# EAGLE schematic Wiegezelle (EAGLE 7.7.0)
AUTHOR: Eltra EW; DESCRIPION: test; DESCRIPTION: Platine an Schlitten; VERSION: V1.0
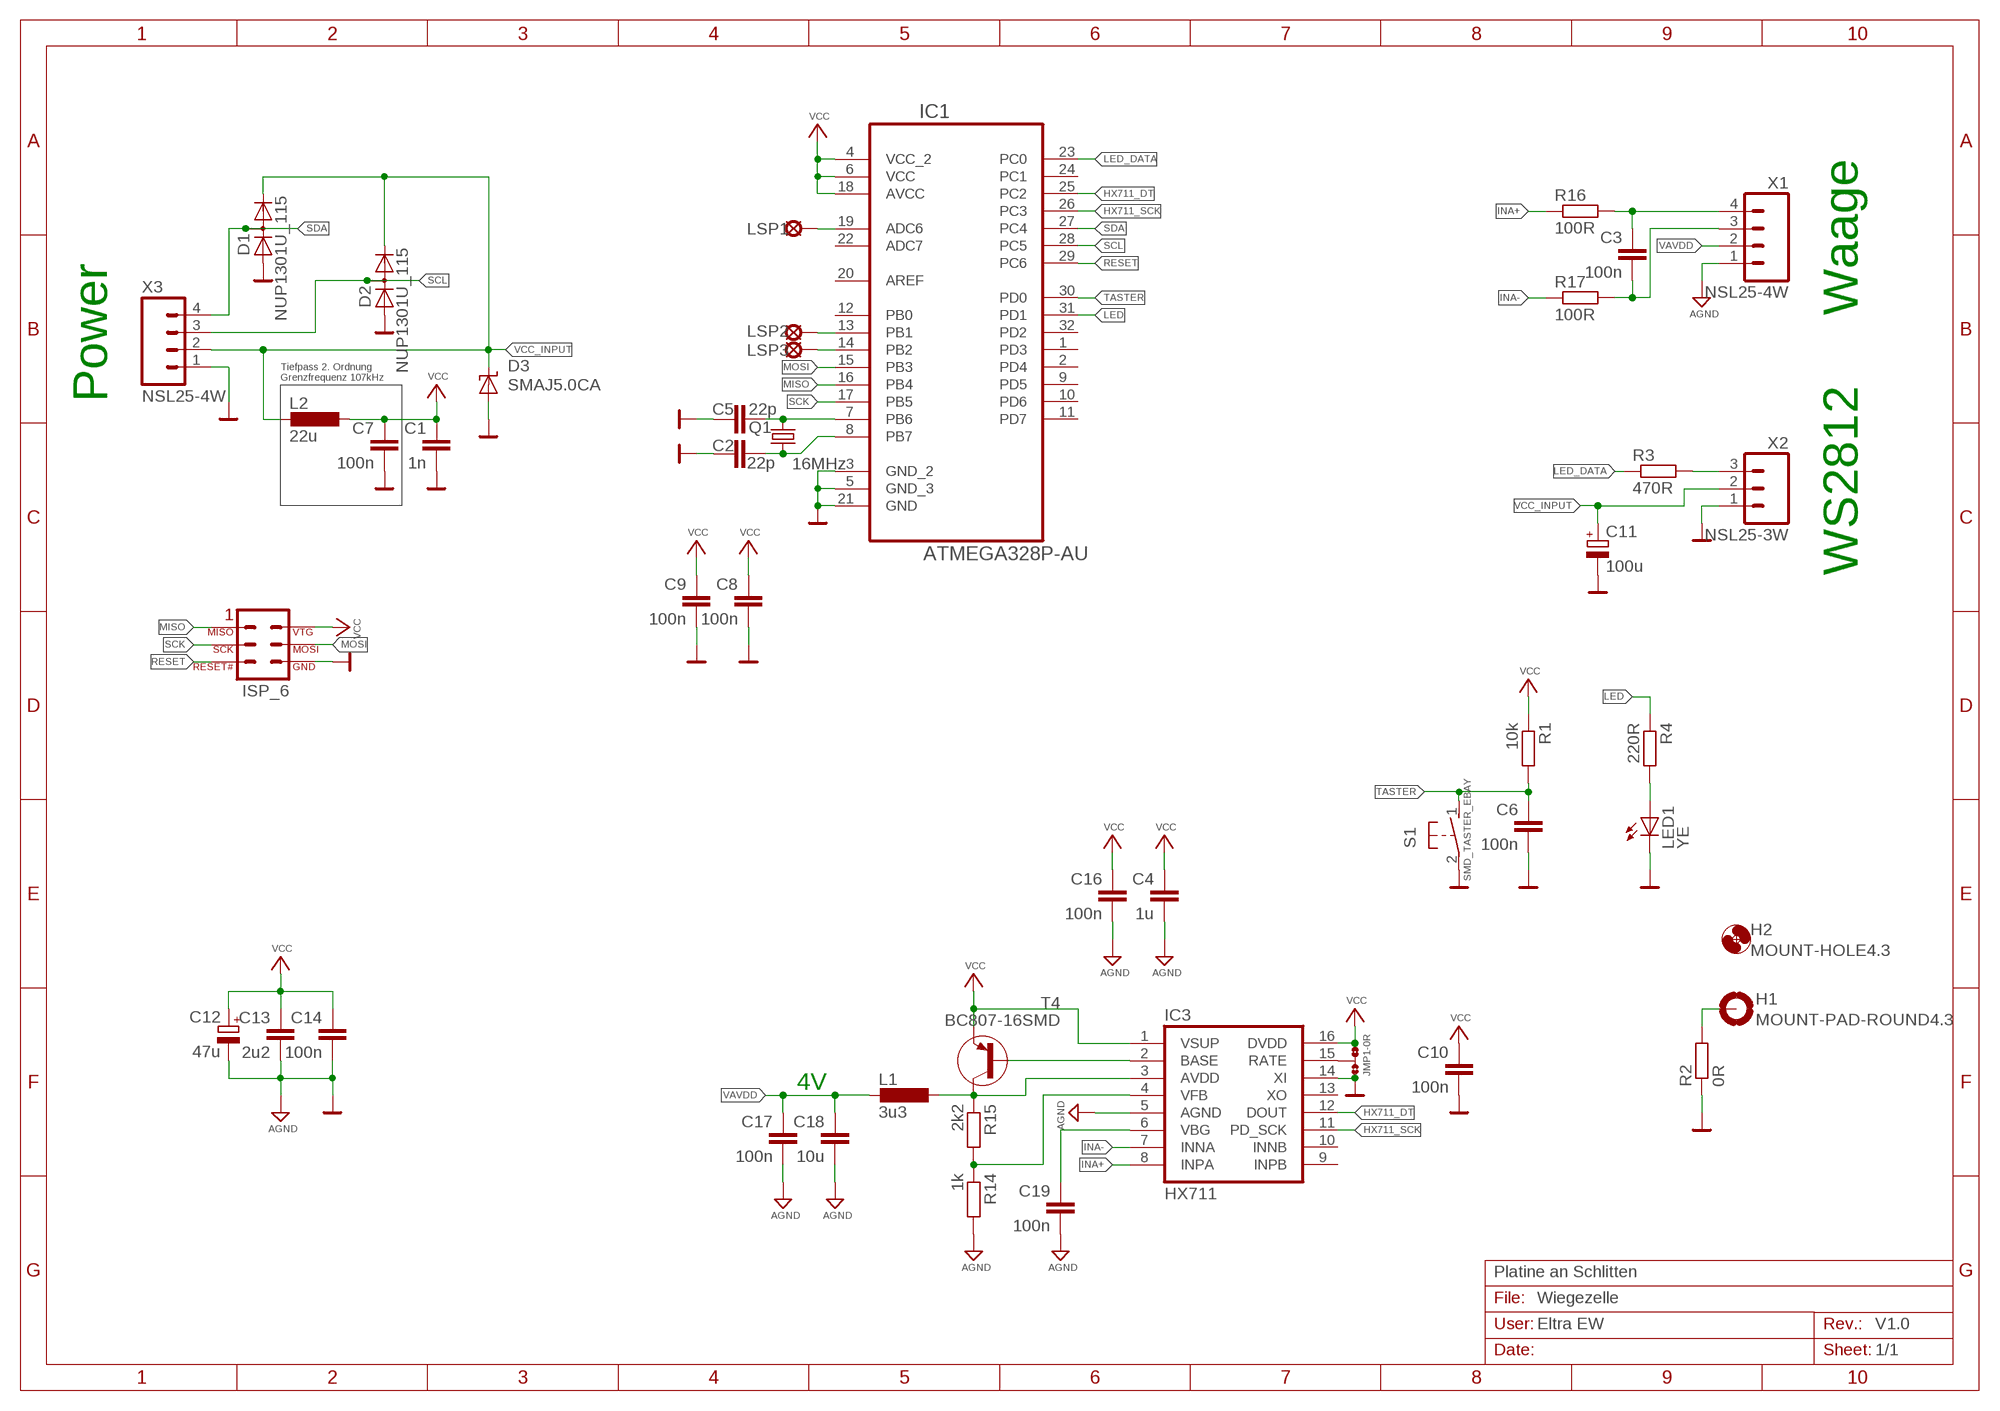
[diagram p0: schematic, sheet 1]

## Parts
C1  1n  C-EUC0805CRH  [0805CRH]
C2  22p  C-EUC0805CRH  [0805CRH]
C3  100n  C-EUC0805CRH  [0805CRH]
C4  1u  C-EUC0805CRH  [0805CRH]
C5  22p  C-EUC0805CRH  [0805CRH]
C6  100n  C-EUC0805CRH  [0805CRH]
C7  100n  C-EUC0805CRH  [0805CRH]
C8  100n  C-EUC0805CRH  [0805CRH]
C9  100n  C-EUC0805CRH  [0805CRH]
C10  100n  C-EUC0805CRH  [0805CRH]
C11  100u  CPOL-EU153CLV-0605  [153CLV-0605]
C12  47u  CPOL-EU153CLV-0405  [153CLV-0405]
C13  2u2  C-EUC0805CRH  [0805CRH]
C14  100n  C-EUC0805CRH  [0805CRH]
C16  100n  C-EUC0805CRH  [0805CRH]
C17  100n  C-EUC0805CRH  [0805CRH]
C18  10u  C-EUC0805CRH  [0805CRH]
C19  100n  C-EUC0805CRH  [0805CRH]
D1  NUP1301U_115  [SOT323-3]
D2  NUP1301U_115  [SOT323-3]
D3  SMAJ5.0CA  SMAJ  [SMA-DO214AC]
H1  MOUNT-PAD-ROUND4.3  [4,3-PAD]
H2  MOUNT-HOLE4.3  [4,3]
IC1  ATMEGA328P-AU  [QFP80P900X900X120-32N]
IC3  HX711  [SO16]
JMP1  0R-JUMPA  [A0R-JMP]
L1  3u3  L-EUL0805CRH  [0805CRH]
L2  22u  L-EUL4532P  [L4532P]
LED1  YE  LEDCHIPLED_0805  [CHIPLED_0805]
LSP1  LSP06  [LSP06]
LSP2  LSP06  [LSP06]
LSP3  LSP06  [LSP06]
Q1  16MHz  CRYSTALHC49UP  [HC49UP]
R1  10k  R-EU_R0805CRH  [0805CRH]
R2  0R  R-EU_R0805CRH  [0805CRH]
R3  470R  R-EU_R0805CRH  [0805CRH]
R4  220R  R-EU_R0805CRH  [0805CRH]
R14  1k  R-EU_R0805CRH  [0805CRH]
R15  2k2  R-EU_R0805CRH  [0805CRH]
R16  100R  R-EU_R0805CRH  [0805CRH]
R17  100R  R-EU_R0805CRH  [0805CRH]
S1  SMD_TASTER_EBAY  [DTSM3XN]
SV1  ATMEL_ISP_6  [ML6]
T4  BC807-16SMD  [SOT23-BEC]
X1  NSL25-4W  [NSL25-4W]
X2  NSL25-3W  [NSL25-3W]
X3  NSL25-4W  [NSL25-4W]

## Nets
AGND: C4.2 C12.- C13.2 C14.2 C16.2 C17.2 C18.2 C19.2 IC3.5(AGND) R14.2 X1.1 ; supply symbol labelled GND
GND: C1.2 C2.1 C5.1 C6.2 C7.2 C8.2 C9.2 C10.2 C11.- D1.1 D2.1 D3.A IC1.3(GND_2) IC1.5(GND_3) IC1.21(GND) IC3.14(XI) JMP1.3 LED1.C R2.1 S1.2(P) SV1.6 X2.1 X3.1
HX711_DT: IC1.25(PC2) IC3.12(DOUT)
HX711_SCK: IC1.26(PC3) IC3.11(PD_SCK)
INA+: IC3.8(INPA) R16.1
INA-: IC3.7(INNA) R17.1
LED: IC1.31(PD1) R4.1
LED_DATA: IC1.23(PC0) R3.1
MISO: IC1.16(PB4) SV1.1
MOSI: IC1.15(PB3) SV1.4
N$1: H1.B4,3(MOUNT) R2.2
N$2: LED1.A R4.2
N$3: R3.2 X2.3
N$4: C5.2 IC1.7(PB6) Q1.2
N$5: C2.2 IC1.8(PB7) Q1.1
N$6: IC1.19(ADC6) LSP1.MP
N$7: IC1.13(PB1) LSP2.MP
N$8: IC1.14(PB2) LSP3.MP
N$12: IC3.15(RATE) JMP1.2
N$13: C19.1 IC3.6(VBG)
N$14: IC3.2(BASE) T4.B
N$16: IC3.4(VFB) R14.1 R15.2
N$18: C3.1 R16.2 X1.4
N$19: C3.2 R17.2 X1.3
RESET: IC1.29(PC6) SV1.5
SCK: IC1.17(PB5) SV1.3
SCL: D2.3 IC1.28(PC5) X3.3
SDA: D1.3 IC1.27(PC4) X3.4
TASTER: C6.1 IC1.30(PD0) R1.2 S1.1(S)
VAVDD: C17.1 C18.1 L1.2 X1.2
VAVDD_1: IC3.3(AVDD) L1.1 R15.1 T4.C
VCC: C1.1 C4.1 C7.1 C8.1 C9.1 C10.1 C12.+ C13.1 C14.1 C16.1 IC1.4(VCC_2) IC1.6(VCC) IC1.18(AVCC) IC3.1(VSUP) IC3.16(DVDD) JMP1.1 L2.1 R1.1 SV1.2 T4.E
VCC_INPUT: C11.+ D1.2 D2.2 D3.K(C) L2.2 X2.2 X3.2
Unconnected: IC1.1(PD3) IC1.2(PD4) IC1.9(PD5) IC1.10(PD6) IC1.11(PD7) IC1.12(PB0) IC1.20(AREF) IC1.22(ADC7) IC1.24(PC1) IC1.32(PD2) IC3.9(INPB) IC3.10(INNB) IC3.13(XO)

## Notes on the sheet
- Waage
- Tiefpass 2. Ordnung
  Grenzfrequenz 107kHz
- Power
- WS2812
- 4V

## Library data of the parts
C1-C10 C13 C14 C16-C19 = rcl_jci:C-EU: CAPACITOR, European symbol
C11 C12 = rcl_jci:CPOL-EU: POLARIZED CAPACITOR, European symbol
D1 D2 = Diode:NUP1301U_115: ESD-Entstörer/TVS-Dioden, SOT-323-3
D3 = Eltra_Teile:SMAJ: Suppressor diode
H1 = holes_sv:MOUNT-PAD-ROUND: MOUNTING PAD, round
H2 = holes_sv:MOUNT-HOLE: MOUNTING HOLE with drill center marker
IC1 = Atmel:ATMEGA328P-AU: 8-bit Microcontroller with In-System Programmable Flash; PACKAGE: TQFP-32; SUPPLIER: Atmel
IC3 = ADC:HX711
JMP1 = jump-0r-smd:0R-JUMP: SMD 0R 0805 Jumper
L1 L2 = rcl_sv:L-EU: INDUCTOR, European symbol
LED1 = led_jci:LED: LED OSRAM: - CHIPLED LG R971, LG N971, LY N971, LG Q971, LY Q971, LO R971, LY R971 LH N974, LH R974 LS Q976, LO Q976, LY Q976 LO Q996 - Hyper CHIPLED LW Q18S LB Q993, LB Q99A, LB R99A - SideLED LS A670, LO A670, LY A670, LG A670, LP A670 LB A673, LV A673, LT A673, LW A673 LH A674 LY A675 LS A676, LA A676, LO A676, LY A676, LW A676 LS A679, LY A679, LG A679 - Hyper Micro SIDELED® LS Y876, LA Y876, LO Y876, LY Y876 LT Y87S - SmartLED LW L88C, LW L88S LB L89C, LB L89S, LG L890 LS L89K, LO L89K, LY L89K LS L896, LA L896, LO L896, LY L896 - TOPLED LS T670, LO T670, LY T670, LG T670, LP T670 LSG T670, LSP T670, LSY T670, LOP T670, LYG T670 LG T671, LOG T671, LSG T671 LB T673, LV T673, LT T673, LW T673 LH T674 LS T676, LA T676, LO T676, LY T676, LB T676, LH T676, LSB T676, LW T676 LB T67C, LV T67C, LT T67C, LS T67K, LO T67K, LY T67K, LW E67C LS E67B, LA E67B, LO E67B, LY E67B, LB E67C, LV E67C, LT E67C LW T67C LS T679, LY T679, LG T679 LS T770, LO T770, LY T770, LG T770, LP T770 LB T773, LV T773, LT T773, LW T773 LH T774 LS E675, LA E675, LY E675, LS T675 LS T776, LA T776, LO T776, LY T776, LB T776 LHGB T686 LT T68C, LB T68C - Hyper Mini TOPLED® LB M676 - Mini TOPLED Santana® LG M470 LS M47K, LO M47K, LY M47K Source: http://www.osram.convergy.de/
LSP1-LSP3 = solpad_jci:LSP: SOLDER PAD
Q1 = crystal_jci:CRYSTAL: CRYSTAL
R1-R4 R14-R17 = rcl_jci:R-EU_: RESISTOR, European symbol
S1 = switch:SMD_TASTER_EBAY: Taster Serie DTSM3xN
SV1 = isp_jci:ATMEL_ISP_6: ATMEL ISP_6
T4 = transistor_sv:BC807*: PNP Transistror
X1 X3 = con-nsk_jci:NSL25-4: Nylonstiftleiste
X2 = con-nsk_jci:NSL25-3: Nylonstiftleiste

## Net classes
0 default: clearance 0.205 mm